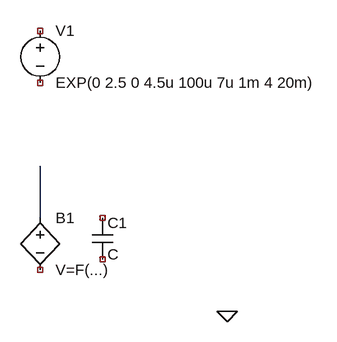
[diagram p0: schematic commande.asc]
commande.asc, the LTspice schematic file:
Version 4
SHEET 1 880 680
WIRE -80 96 -80 16
FLAG 208 240 0
SYMBOL cap 0 96 R0
SYMATTR InstName C1
SYMBOL bv -80 80 R0
SYMATTR InstName B1
SYMBOL voltage -80 -208 R0
WINDOW 123 0 0 Left 0
WINDOW 39 0 0 Left 0
SYMATTR InstName V1
SYMATTR Value EXP(0 2.5 0 4.5u 100u 7u 1m 4 20m)

The netlist it stands for:
* commande.asc
C1 NC_01 NC_02 C
B1 N001 NC_03 V=F(...)
V1 NC_04 NC_05 EXP(0 2.5 0 4.5u 100u 7u 1m 4 20m)
.backanno
.end